# Altium schematic sheet Gigabit Ethernet.SchDoc: Gigabit Ethernet
size A3; DocumentNumber: 7; Revision: A; SheetNumber: 7; SheetTotal: 10
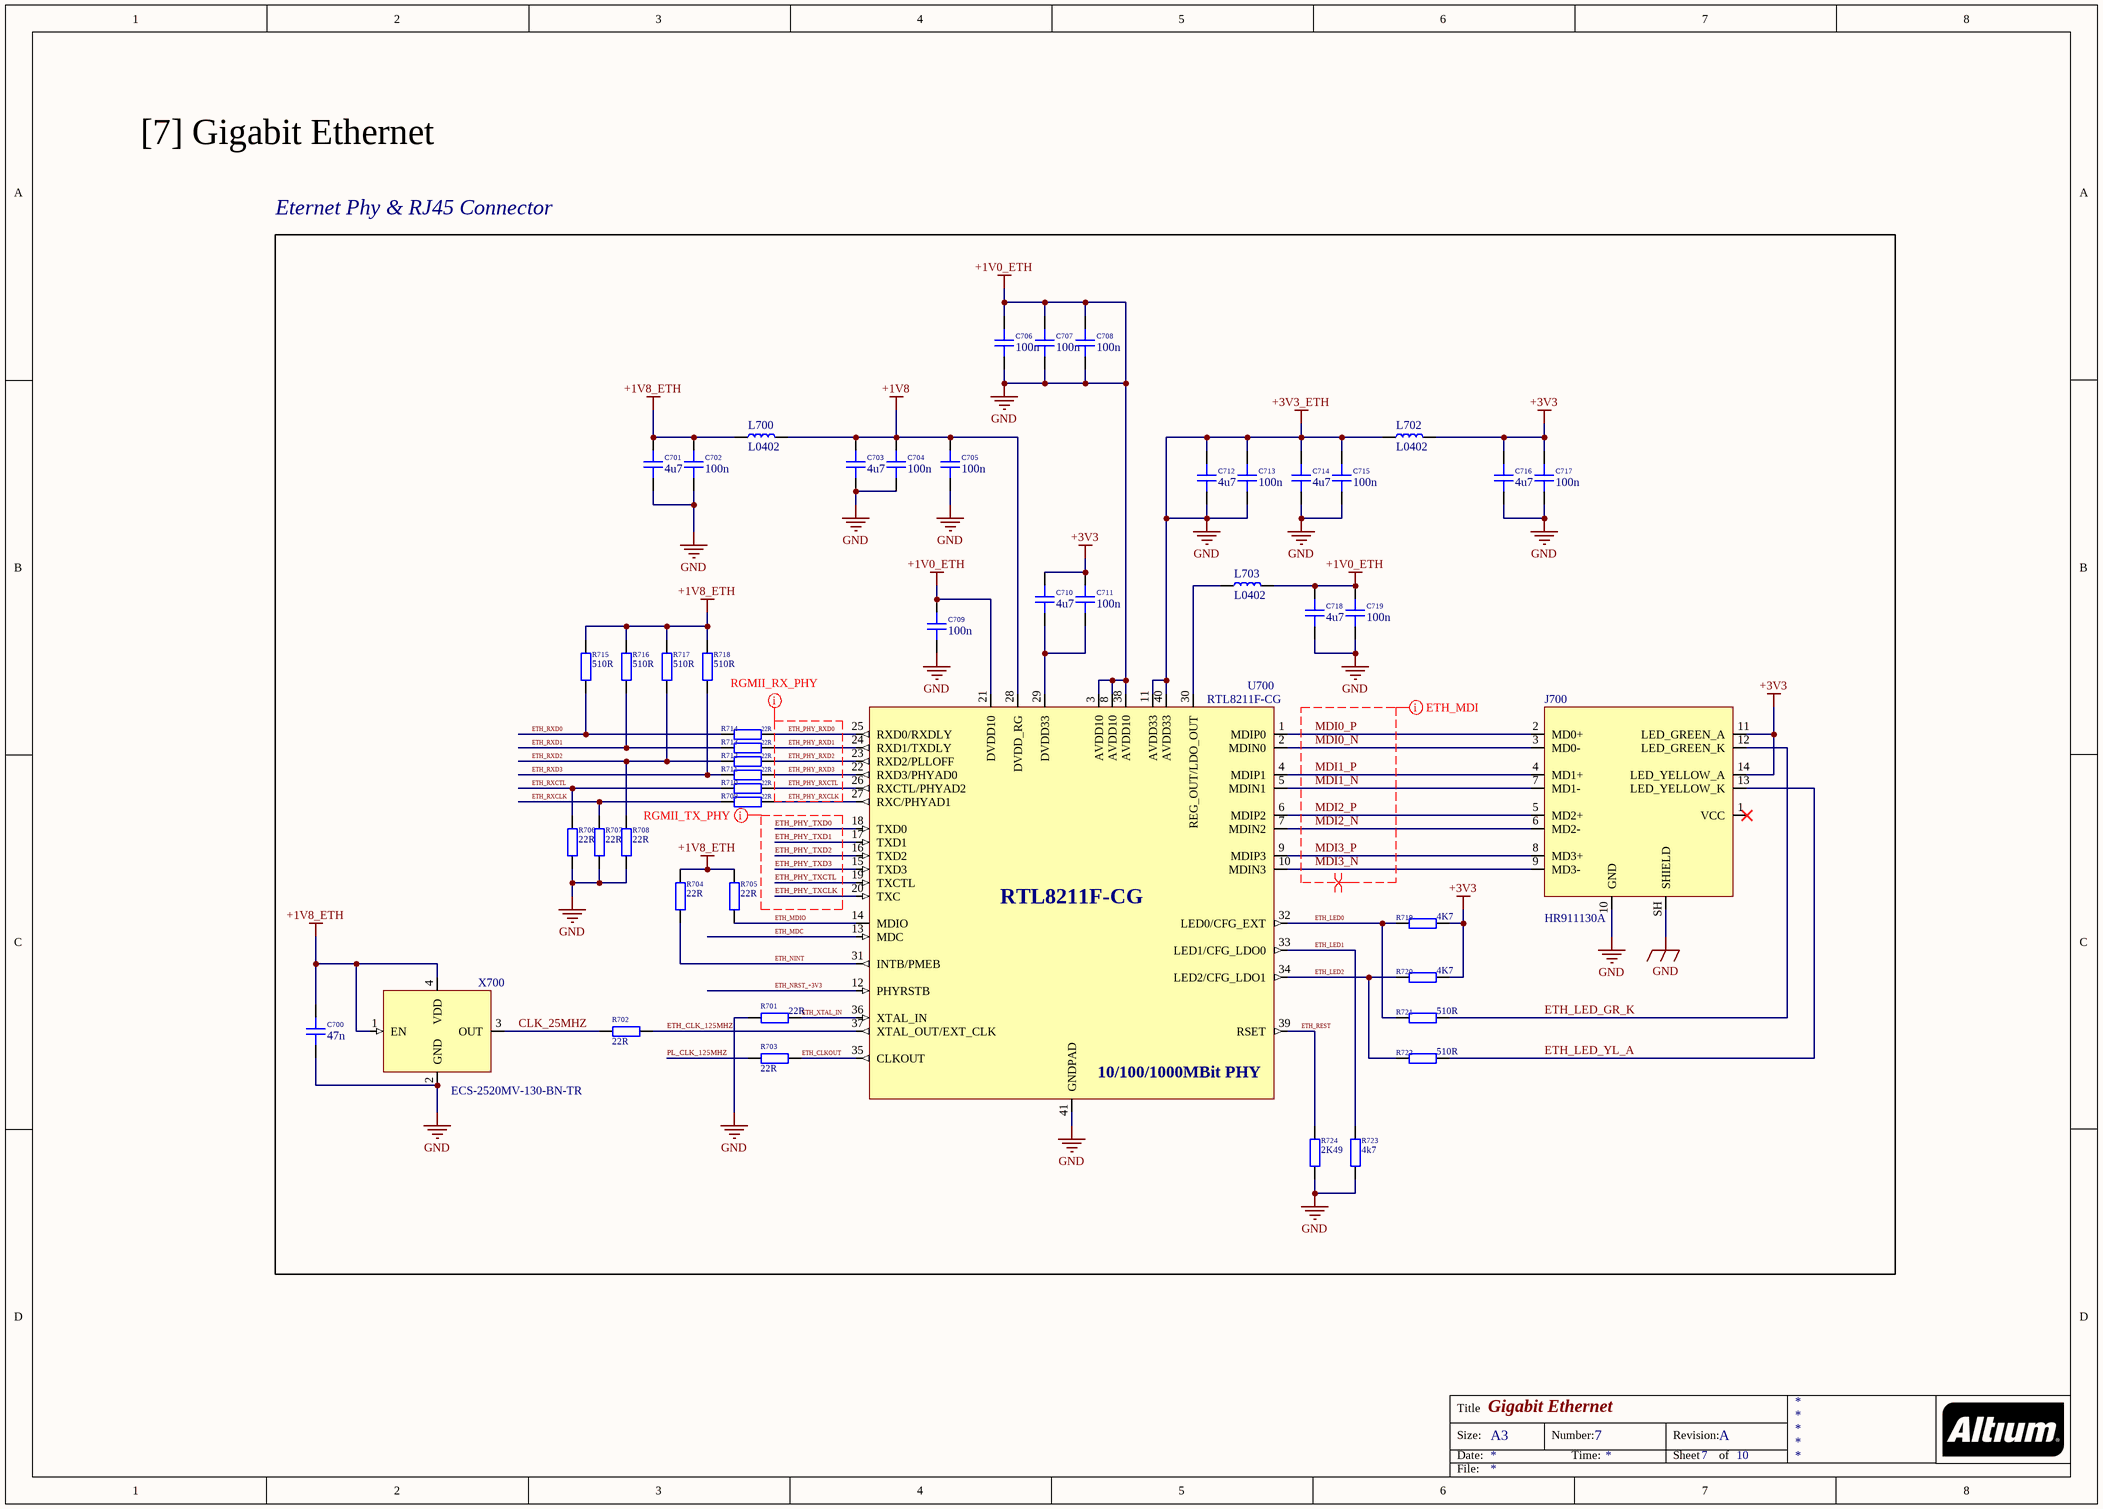
[diagram p0: Gigabit Ethernet.SchDoc]

## Parts
C700  47n  [CAP_1210]
C701  4u7  [CAP_1210]
C702  100n  [CAP_1210]
C703  4u7  [CAP_1210]
C704  100n  [CAP_1210]
C705  100n  [CAP_1210]
C706  100n  [CAP_1210]
C707  100n  [CAP_1210]
C708  100n  [CAP_1210]
C709  100n  [CAP_1210]
C710  4u7  [CAP_1210]
C711  100n  [CAP_1210]
C712  4u7  [CAP_1210]
C713  100n  [CAP_1210]
C714  4u7  [CAP_1210]
C715  100n  [CAP_1210]
C716  4u7  [CAP_1210]
C717  100n  [CAP_1210]
C718  4u7  [CAP_1210]
C719  100n  [CAP_1210]
J700  HR911130A  [HR911130A]
L700  L0402  [IND_0402]
L702  L0402  [IND_0402]
L703  L0402  [IND_0402]
R701  22R  [RES_0402]
R702  22R  [RES_0402]
R703  22R  [RES_0402]
R704  22R  [RES_0402]
R705  22R  [RES_0402]
R706  22R  [RES_0402]
R707  22R  [RES_0402]
R708  22R  [RES_0402]
R709  22R  [RES_0402]
R710  22R  [RES_0402]
R711  22R  [RES_0402]
R712  22R  [RES_0402]
R713  22R  [RES_0402]
R714  22R  [RES_0402]
R715  510R  [RES_0402]
R716  510R  [RES_0402]
R717  510R  [RES_0402]
R718  510R  [RES_0402]
R719  4K7  [RES_0402]
R720  4K7  [RES_0402]
R721  510R  [RES_0402]
R722  510R  [RES_0402]
R723  4k7  [RES_0402]
R724  2K49  [RES_0402]
U700  RTL8211F-CG  [QFN-40-0.4-EP]
X700  ECS-2520MV-130-BN-TR  [XTAL_2520]

## Blocks framed on the sheet
Eternet Phy & RJ45 Connector: C700-C719 J700 L700 L702 L703 R701-R724 U700 X700

## Nets
+1V0_ETH: C700.1 C701.1 C702.1 C703.1 C704.1 C705.1 C706.1 C706.2 C707.1 C707.2 C708.1 C708.2 C709.1 C709.2 C712.1 C712.2 C713.1 C713.2 C714.1 C714.2 C715.1 C715.2 C716.1 C717.1 C718.1 C718.2 C719.1 C719.2 J700.10(GND) J700.SH(SHIELD) L702.1 L703.2 R701.1 R706.1 R707.1 R708.1 R723.1 R724.1 U700.3(AVDD10) U700.8(AVDD10) U700.11(AVDD33) U700.21(DVDD10) U700.38(AVDD10) U700.40(AVDD33) U700.41(GNDPAD) X700.2(GND)  [also labelled +3V3_ETH, GND]
+1V8: C703.2 C704.2 C705.2 L700.2 U700.28(DVDD_RG)
+1V8_ETH: C700.2 C701.2 C702.2 L700.1 R704.2 R705.2 R715.2 R716.2 R717.2 R718.2 X700.1(EN) X700.4(VDD)
+3V3: C710.2 C711.2 C716.2 C717.2 J700.11(LED_GREEN_A) J700.14(LED_YELLOW_A) L702.2 R719.2 R720.2
CLK_25MHZ: R702.2 X700.3(OUT)
ETH_CLK_125MHZ: R702.1 U700.37(XTAL_OUT/EXT_CLK)
ETH_CLKOUT: R703.1 U700.35(CLKOUT)
ETH_LED0: R719.1 R721.1 U700.32(LED0/CFG_EXT)
ETH_LED1: R723.2 U700.33(LED1/CFG_LDO0)
ETH_LED2: R720.1 R722.1 U700.34(LED2/CFG_LDO1)
ETH_LED_GR_K: J700.12(LED_GREEN_K) R721.2
ETH_LED_YL_A: J700.13(LED_YELLOW_K) R722.2
ETH_MDC: U700.13(MDC)
ETH_MDIO: R705.1 U700.14(MDIO)
ETH_NINT: R704.1 U700.31(INTB/PMEB)
ETH_NRST_+3V3: U700.12(PHYRSTB)
ETH_PHY_RXCLK: R709.2 U700.27(RXC/PHYAD1)
ETH_PHY_RXCTL: R710.2 U700.26(RXCTL/PHYAD2)
ETH_PHY_RXD0: R714.2 U700.25(RXD0/RXDLY)
ETH_PHY_RXD1: R713.2 U700.24(RXD1/TXDLY)
ETH_PHY_RXD2: R712.2 U700.23(RXD2/PLLOFF)
ETH_PHY_RXD3: R711.2 U700.22(RXD3/PHYAD0)
ETH_PHY_TXCLK: U700.20(TXC)
ETH_PHY_TXCTL: U700.19(TXCTL)
ETH_PHY_TXD0: U700.18(TXD0)
ETH_PHY_TXD1: U700.17(TXD1)
ETH_PHY_TXD2: U700.16(TXD2)
ETH_PHY_TXD3: U700.15(TXD3)
ETH_REST: R724.2 U700.39(RSET)
ETH_RXCLK: R707.2 R709.1
ETH_RXCTL: R706.2 R710.1
ETH_RXD0: R714.1 R715.1
ETH_RXD1: R713.1 R716.1
ETH_RXD2: R708.2 R712.1 R717.1
ETH_RXD3: R711.1 R718.1
ETH_XTAL_IN: R701.2 U700.36(XTAL_IN)
MDI0_N: J700.3(MD0-) U700.2(MDIN0)
MDI0_P: J700.2(MD0+) U700.1(MDIP0)
MDI1_N: J700.7(MD1-) U700.5(MDIN1)
MDI1_P: J700.4(MD1+) U700.4(MDIP1)
MDI2_N: J700.6(MD2-) U700.7(MDIN2)
MDI2_P: J700.5(MD2+) U700.6(MDIP2)
MDI3_N: J700.9(MD3-) U700.10(MDIN3)
MDI3_P: J700.8(MD3+) U700.9(MDIP3)
PL_CLK_125MHZ: R703.2
NetC710_1: C710.1 C711.1 U700.29(DVDD33)
NetL703_1: L703.1 U700.30(REG_OUT/LDO_OUT)

Not connected (* = marked no-connect by the designer): J700 1(VCC)*

## Layout directives
mark named ETH_MDI: MDI0_N, MDI0_P, MDI1_N, MDI1_P, MDI2_N, MDI2_P, MDI3_N, MDI3_P
differential pair: MDI0_N, MDI0_P, MDI1_N, MDI1_P, MDI2_N, MDI2_P, MDI3_N, MDI3_P
mark named RGMII_RX_PHY: ETH_PHY_RXCLK, ETH_PHY_RXCTL, ETH_PHY_RXD0, ETH_PHY_RXD1, ETH_PHY_RXD2, ETH_PHY_RXD3
mark named RGMII_TX_PHY: ETH_PHY_TXCLK, ETH_PHY_TXCTL, ETH_PHY_TXD0, ETH_PHY_TXD1, ETH_PHY_TXD2, ETH_PHY_TXD3

## Notes on the sheet
- [7] Gigabit Ethernet
- Title
- Size:
- Date:
- A3
- Number:
- Time:
- Revision:
- Sheet
- of
- File:
- (in symbol RTL8211F-CG) 10/100/1000MBit PHY

## Library data of the parts
C700-C719 = CAP_1210: Capacitor SMD 1210; Manufacturer: *; Manufacturer Part Number: *; Distributor Link: *; LCSC: *; Rating: *; Dielectric: *
J700 = HR911130A: 100/1000Base-T Magnetics Single-Port RJ45 Connector with Integrated Magnetics and LEDs; Manufacturer: Hanrun; Manufacturer Part Number: HR911130A
L700 L702 L703 = IND_0402: Inductor SMD 0402
R701-R724 = RES_0402: Resistor SMD 0402; Manufacturer: *; Manufacturer Part Number: *; Distributor Link: *; LCSC: *
U700 = RTL8211F-CG: INTEGRATED 10/100/1000M ETHERNET PRECISION TRANSCEIVER; Manufacturer: Realtek; Manufacturer Part Number: RTL8211F-CG
X700 = ECS-2520MV-130-BN-TR: Standard Clock Oscillators XO (Standard),13MHz,Standby (Power Down),CMOS, Multi-Volt,1.6 V 3.6 V,+/-50ppm,-40 C 85 C,6mA,Surface Mount,4-SMD, No Lead,(2.50mm x 2.00mm),(0.80mm); Manufacturer: ECS; Manufacturer Part Number: ECS-2520MV-130-BN-TR